# EAGLE schematic exixe_pogo (EAGLE 8.5.0)
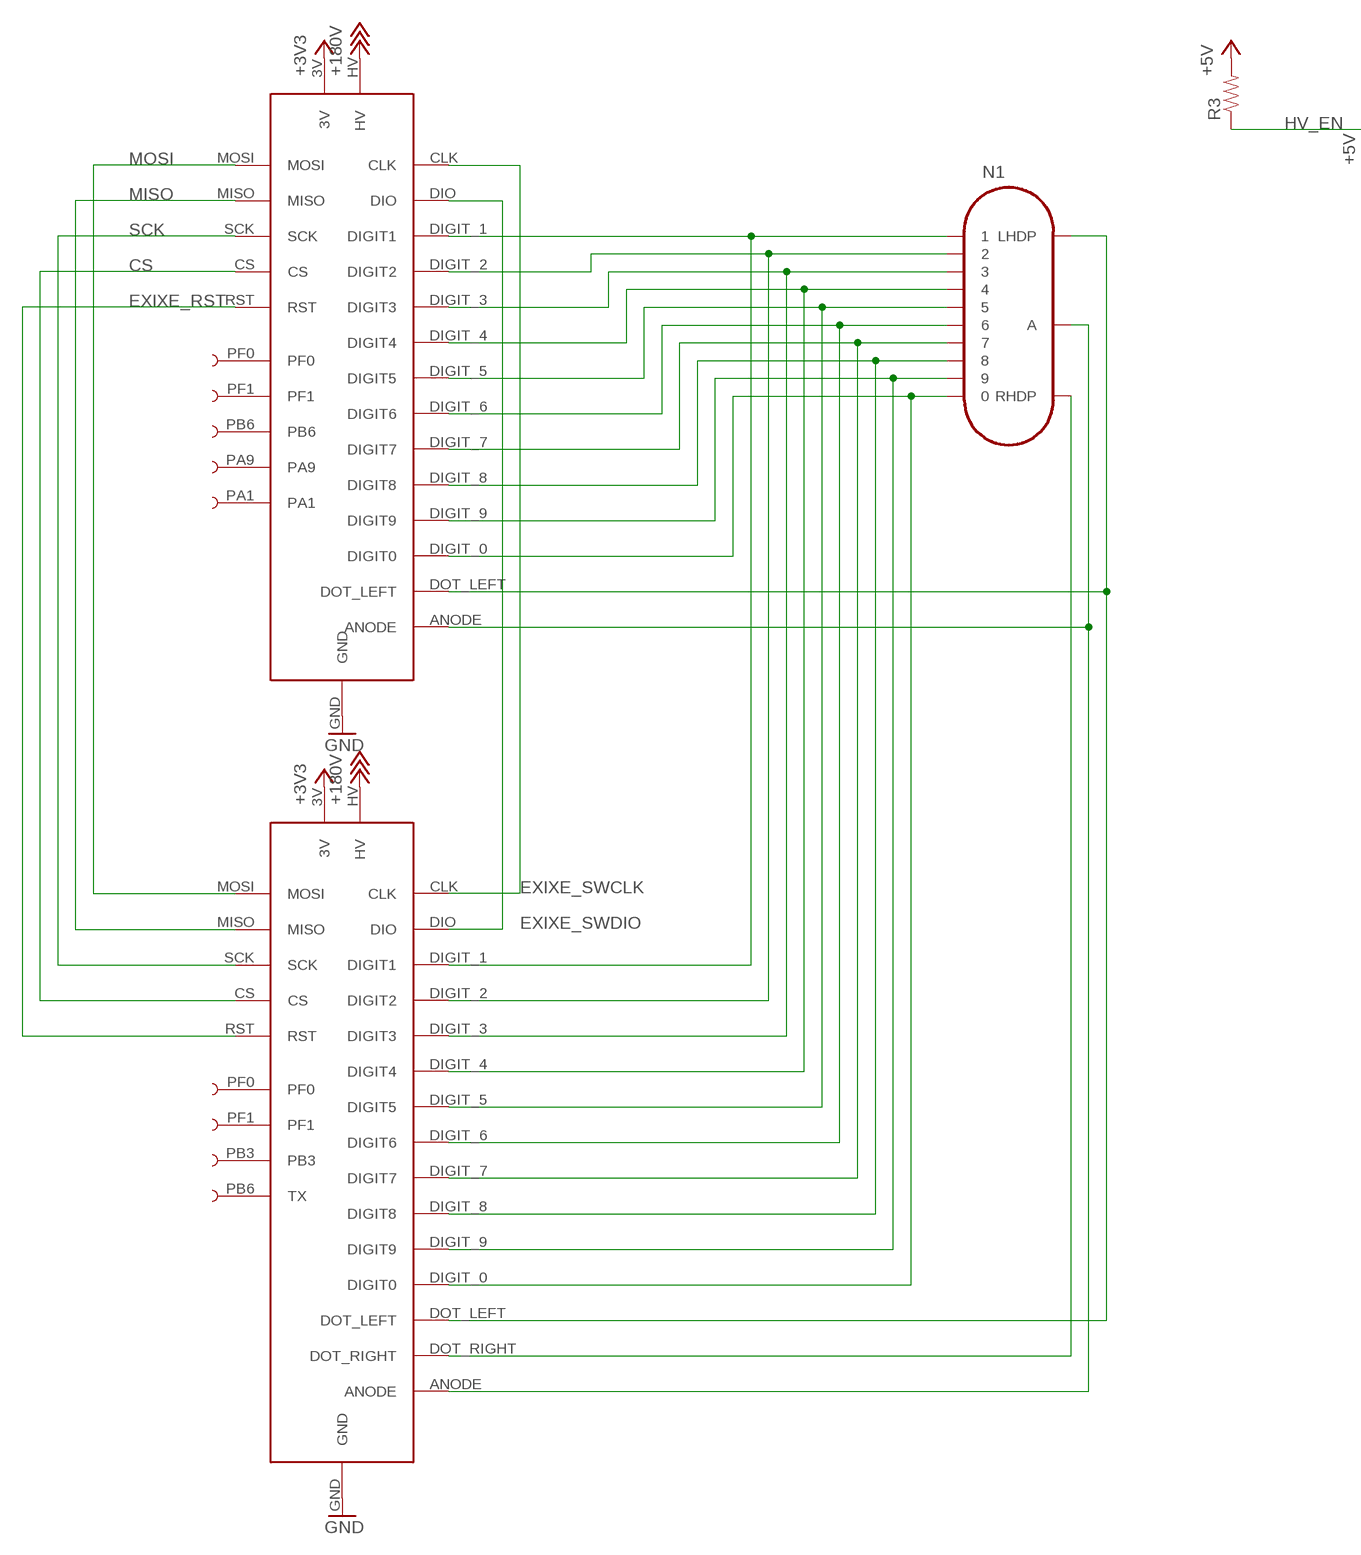
[diagram p0: schematic, sheet 1, part 1 of 2]
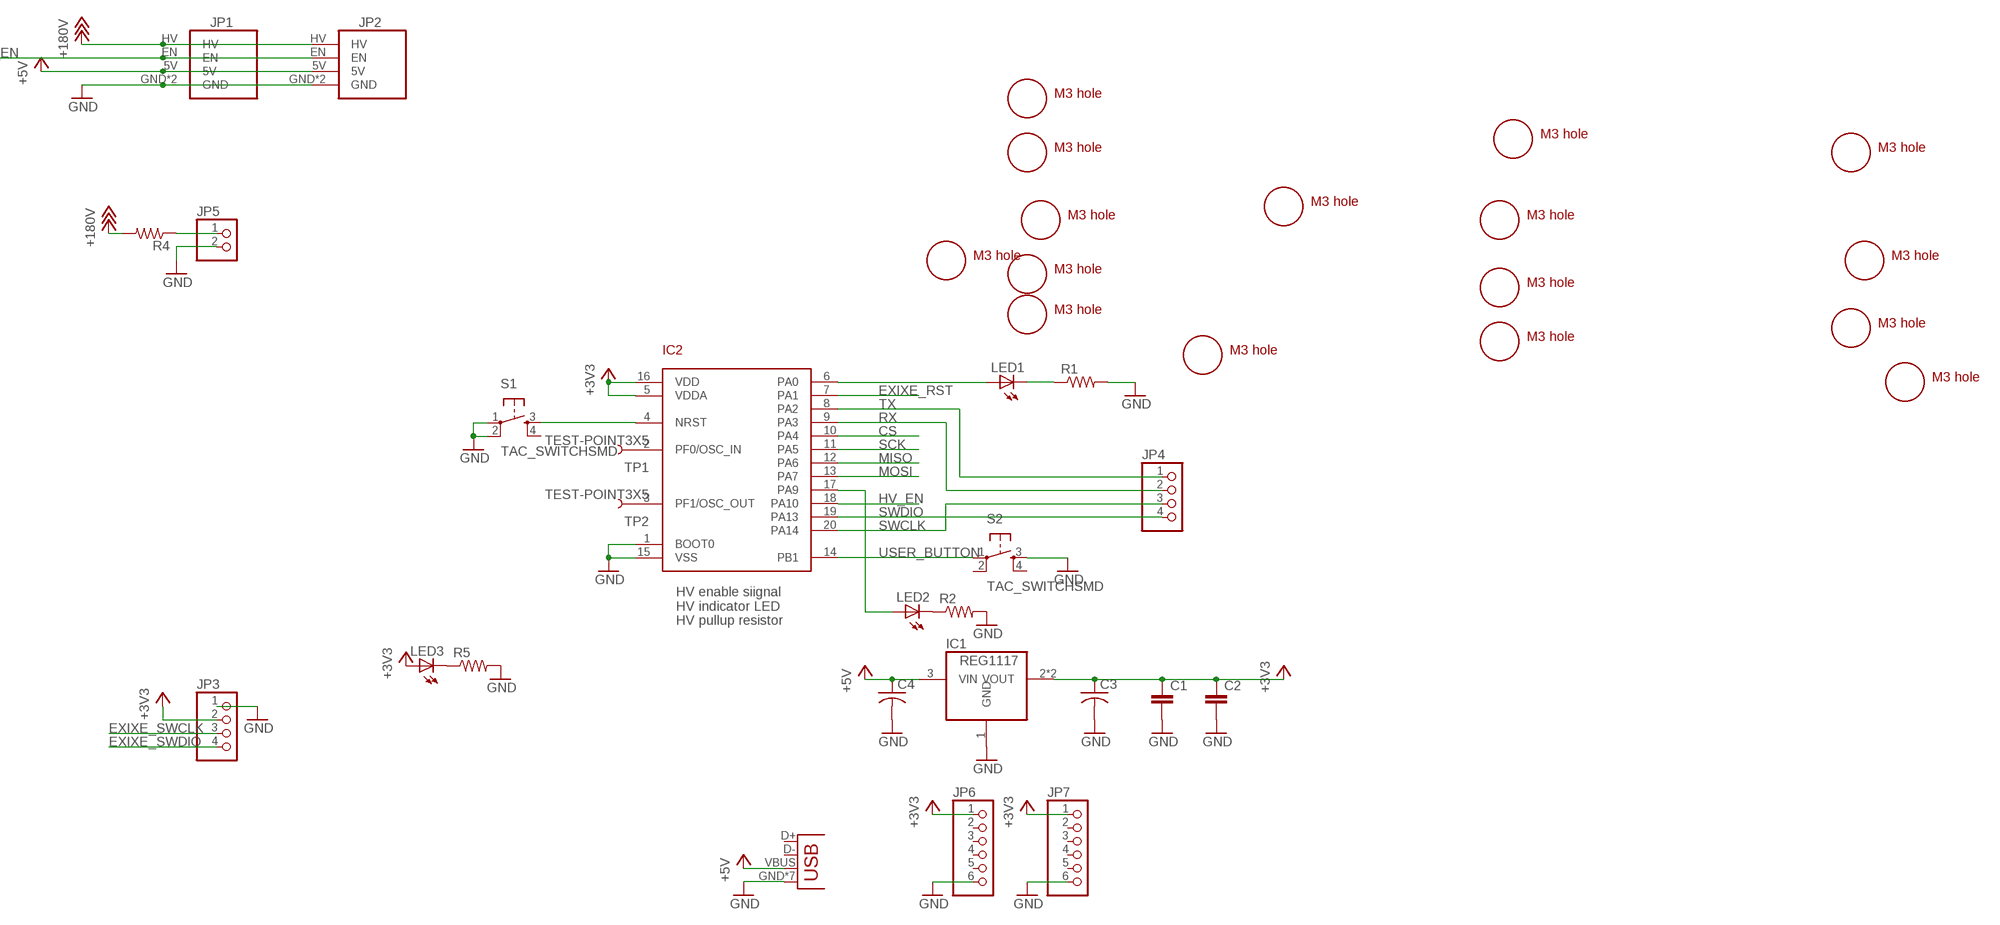
[diagram p1: schematic, sheet 1, part 2 of 2]

## Parts
C1  CAP0805  [0805]
C2  CAP0805  [0805]
C3  C-USC1210  [C1210]
C4  C-USC1210  [C1210]
IC1  REG1117  [SOT223]
IC2  STM32F030F4  [TSSOP20]
JP1  EBAY_MODULEEBAY  [EBAY_PKG]
JP2  EBAY_MODULETAOBAO  [TAOBAO_PKG]
JP3  PINHD-1X4  [1X04]
JP4  PINHD-1X4  [1X04]
JP5  PINHD-1X2  [1X02]
JP6  PINHD-1X6  [1X06]
JP7  PINHD-1X6  [1X06]
LED1  LEDCHIP-LED0805  [CHIP-LED0805]
LED2  LEDCHIP-LED0805  [CHIP-LED0805]
LED3  LEDCHIP-LED0805  [CHIP-LED0805]
N1  IN-14  [IN-14]
R1  RESISTOR0805-RES  [0805]
R2  RESISTOR0805-RES  [0805]
R3  RESISTOR0805-RES  [0805]
R4  RESISTOR0805-RES  [0805]
R5  RESISTOR0805-RES  [0805]
S1  TAC_SWITCHSMD  [TACTILE-SWITCH-SMD]
S2  TAC_SWITCHSMD  [TACTILE-SWITCH-SMD]
TP1  TEST-POINT3X5  [PAD.03X.05]
TP2  TEST-POINT3X5  [PAD.03X.05]
TP3  TEST-POINT3X5  [PAD.03X.05]
TP4  TEST-POINT3X5  [PAD.03X.05]
TP5  TEST-POINT3X5  [PAD.03X.05]
TP6  TEST-POINT3X5  [PAD.03X.05]
TP7  TEST-POINT3X5  [PAD.03X.05]
TP8  TEST-POINT3X5  [PAD.03X.05]
TP9  TEST-POINT3X5  [PAD.03X.05]
TP10  TEST-POINT3X5  [PAD.03X.05]
TP11  TEST-POINT3X5  [PAD.03X.05]
U$1  EXIXE12_POGO  [EXIXE12_PAC]
U$2  EXIXE14_POGO  [EXIXE14_PAC]
U$3  M3_MOUNTING_HOLE  [M3_MOUNTING_HOLE_PACK]
U$4  M3_MOUNTING_HOLE  [M3_MOUNTING_HOLE_PACK]
U$5  M3_MOUNTING_HOLE  [M3_MOUNTING_HOLE_PACK]
U$6  M3_MOUNTING_HOLE  [M3_MOUNTING_HOLE_PACK]
U$7  M3_MOUNTING_HOLE  [M3_MOUNTING_HOLE_PACK]
U$8  M3_MOUNTING_HOLE  [M3_MOUNTING_HOLE_PACK]
U$9  M3_MOUNTING_HOLE  [M3_MOUNTING_HOLE_PACK]
U$10  M3_MOUNTING_HOLE  [M3_MOUNTING_HOLE_PACK]
U$11  M3_MOUNTING_HOLE  [M3_MOUNTING_HOLE_PACK]
U$12  M3_MOUNTING_HOLE  [M3_MOUNTING_HOLE_PACK]
U$13  M3_MOUNTING_HOLE  [M3_MOUNTING_HOLE_PACK]
U$14  M3_MOUNTING_HOLE  [M3_MOUNTING_HOLE_PACK]
U$15  M3_MOUNTING_HOLE  [M3_MOUNTING_HOLE_PACK]
U$16  M3_MOUNTING_HOLE  [M3_MOUNTING_HOLE_PACK]
U$17  M3_MOUNTING_HOLE  [M3_MOUNTING_HOLE_PACK]
U$18  M3_MOUNTING_HOLE  [M3_MOUNTING_HOLE_PACK]
X1  USB-MICROB  [USB-MICROB]

## Nets
+3V3: C1.1 C2.1 C3.1 IC1.2(VOUT) IC1.4(VOUT) IC2.5(VDDA) IC2.16(VDD) JP3.2 JP6.1 JP7.1 LED3.A U$1.3V U$2.3V
+5V: C4.1 IC1.3(VIN) JP1.5V JP2.5V R3.2 X1.VBUS
+180V: JP1.HV JP2.HV R4.2 U$1.HV U$2.HV
CS: IC2.10(PA4) U$1.CS U$2.CS
EXIXE_RST: IC2.7(PA1) U$1.RST U$2.RST
EXIXE_SWCLK: JP3.3 U$1.CLK U$2.CLK
EXIXE_SWDIO: JP3.4 U$1.DIO U$2.DIO
GND: C1.2 C2.2 C3.2 C4.2 IC1.1(GND) IC2.1(BOOT0) IC2.15(VSS) JP1.GND JP1.GND2(GND) JP2.GND JP2.GND2(GND) JP3.1 JP5.2 JP6.6 JP7.6 R1.2 R2.2 R5.2 S1.1 S1.2 S2.3 U$1.GND U$2.GND X1.GND X1.P1(GND) X1.P2(GND) X1.P3(GND) X1.P4(GND) X1.P5(GND) X1.P6(GND)
HV_EN: IC2.18(PA10) JP1.EN JP2.EN R3.1
MISO: IC2.12(PA6) U$1.MISO U$2.MISO
MOSI: IC2.13(PA7) U$1.MOSI U$2.MOSI
N$1: N1.1 U$1.DIGIT_1(DIGIT1) U$2.DIGIT_1(DIGIT1)
N$2: IC2.4(NRST) S1.3
N$3: N1.2 U$1.DIGIT_2(DIGIT2) U$2.DIGIT_2(DIGIT2)
N$4: N1.3 U$1.DIGIT_3(DIGIT3) U$2.DIGIT_3(DIGIT3)
N$5: N1.4 U$1.DIGIT_4(DIGIT4) U$2.DIGIT_4(DIGIT4)
N$6: N1.5 U$1.DIGIT_5(DIGIT5) U$2.DIGIT_5(DIGIT5)
N$7: N1.6 U$1.DIGIT_6(DIGIT6) U$2.DIGIT_6(DIGIT6)
N$8: N1.7 U$1.DIGIT_7(DIGIT7) U$2.DIGIT_7(DIGIT7)
N$9: N1.8 U$1.DIGIT_8(DIGIT8) U$2.DIGIT_8(DIGIT8)
N$10: N1.9 U$1.DIGIT_9(DIGIT9) U$2.DIGIT_9(DIGIT9)
N$11: N1.0 U$1.DIGIT_0(DIGIT0) U$2.DIGIT_0(DIGIT0)
N$12: N1.RHDP U$2.DOT_RIGHT
N$13: N1.LHDP U$1.DOT_LEFT U$2.DOT_LEFT
N$14: N1.A U$1.ANODE U$2.ANODE
N$15: LED1.C R1.1
N$16: IC2.6(PA0) LED1.A
N$17: JP5.1 R4.1
N$18: LED2.C R2.1
N$19: IC2.17(PA9) LED2.A
N$20: IC2.2(PF0/OSC_IN) TP1.P$1
N$21: IC2.3(PF1/OSC_OUT) TP2.P$1
N$22: TP4.P$1 U$1.PF1
N$23: TP5.P$1 U$1.PB6
N$24: TP6.P$1 U$1.PA9
N$25: TP7.P$1 U$1.PA1
N$26: TP8.P$1 U$2.PF0
N$27: TP9.P$1 U$2.PF1
N$28: TP10.P$1 U$2.PB3
N$29: TP11.P$1 U$2.PB6(TX)
N$30: TP3.P$1 U$1.PF0
N$31: LED3.C R5.1
RX: IC2.9(PA3) JP4.2
SCK: IC2.11(PA5) U$1.SCK U$2.SCK
SWCLK: IC2.20(PA14) JP4.3
SWDIO: IC2.19(PA13) JP4.4
TX: IC2.8(PA2) JP4.1
USER_BUTTON: IC2.14(PB1) S2.1
Unconnected: JP6.2 JP6.3 JP6.4 JP6.5 JP7.2 JP7.3 JP7.4 JP7.5 S1.4 S2.2 S2.4 X1.D+ X1.D-

## Notes on the sheet
- HV enable siignal
  HV indicator LED
  HV pullup resistor

## Library data of the parts
C1 C2 = clock:CAP: Capacitor Standard 0603 ceramic capacitor, and 0.1" leaded capacitor.
C3 C4 = clock:C-US: CAPACITOR, American symbol
IC1 = clock:REG1117: 800mA and 1A Low Dropout (LDO) Positive Regulator 1.8V, 2.5V, 2.85V, 3.3V, 5V, and Adj; MPN: REG1117; OC_FARNELL: 1097566; OC_NEWARK: 14P6981
IC2 = stm32f030f4:STM32F030F4
JP1 JP2 = clock:EBAY_MODULE: PIN HEADER
JP3 JP4 = pinhead:PINHD-1X4: PIN HEADER
JP5 = pinhead:PINHD-1X2: PIN HEADER
JP6 JP7 = pinhead:PINHD-1X6: PIN HEADER
LED1-LED3 = clock:LED: LED OSRAM: - CHIPLED LG R971, LG N971, LY N971, LG Q971, LY Q971, LO R971, LY R971 LH N974, LH R974 LS Q976, LO Q976, LY Q976 LO Q996 - Hyper CHIPLED LW Q18S LB Q993, LB Q99A, LB R99A - SideLED LS A670, LO A670, LY A670, LG A670, LP A670 LB A673, LV A673, LT A673, LW A673 LH A674 LY A675 LS A676, LA A676, LO A676, LY A676, LW A676 LS A679, LY A679, LG A679 - Hyper Micro SIDELED® LS Y876, LA Y876, LO Y876, LY Y876 LT Y87S - SmartLED LW L88C, LW L88S LB L89C, LB L89S, LG L890 LS L89K, LO L89K, LY L89K LS L896, LA L896, LO L896, LY L896 - TOPLED LS T670, LO T670, LY T670, LG T670, LP T670 LSG T670, LSP T670, LSY T670, LOP T670, LYG T670 LG T671, LOG T671, LSG T671 LB T673, LV T673, LT T673, LW T673 LH T674 LS T676, LA T676, LO T676, LY T676, LB T676, LH T676, LSB T676, LW T676 LB T67C, LV T67C, LT T67C, LS T67K, LO T67K, LY T67K, LW E67C LS E67B, LA E67B, LO E67B, LY E67B, LB E67C, LV E67C, LT E67C LW T67C LS T679, LY T679, LG T679 LS T770, LO T770, LY T770, LG T770, LP T770 LB T773, LV T773, LT T773, LW T773 LH T774 LS E675, LA E675, LY E675, LS T675 LS T776, LA T776, LO T776, LY T776, LB T776 LHGB T686 LT T68C, LB T68C - Hyper Mini TOPLED® LB M676 - Mini TOPLED Santana® LG M470 LS M47K, LO M47K, LY M47K Source: http://www.osram.convergy.de/
N1 = exixe14:IN-14: IN-14: medium numeric frontview nixie tube
R1-R5 = clock:RESISTOR: Resistor Basic schematic elements and footprints for 0603, 1206, and PTH resistors.
S1 S2 = clock:TAC_SWITCH: Momentary Switch Button commonly used for reset or general input. Spark Fun Electronics SKU : COM-00097 SMT- SWCH-08247; PROD_ID: SWCH-08247
TP1-TP11 = clock:TEST-POINT: Bare copper test points for troubleshooting or ICT
U$1 = exixe_module:EXIXE12_POGO
U$2 = exixe_module:EXIXE14_POGO
U$3-U$18 = clock:M3_MOUNTING_HOLE
X1 = clock:USB: USB Connectors USB-B-PTH is fully proven SKU : PRT-00139/CONN-08278 USB-miniB is fully proven SKU : PRT-00587 USB-A-PCB is untested. USB-A-H is throughly reviewed, but untested. Spark Fun Electronics SKU : PRT-00437 USB-B-SMT is throughly reviewed, but untested. Needs silkscreen touching up. USB-A-S has not been used/tested USB-MB-H has not been used/tested USB-MICROB has been used. CONN-09505; PROD_ID: CONN-09505